# EAGLE board LCD-OLINUXINO-7TS_Rev_F (EAGLE 4.16)
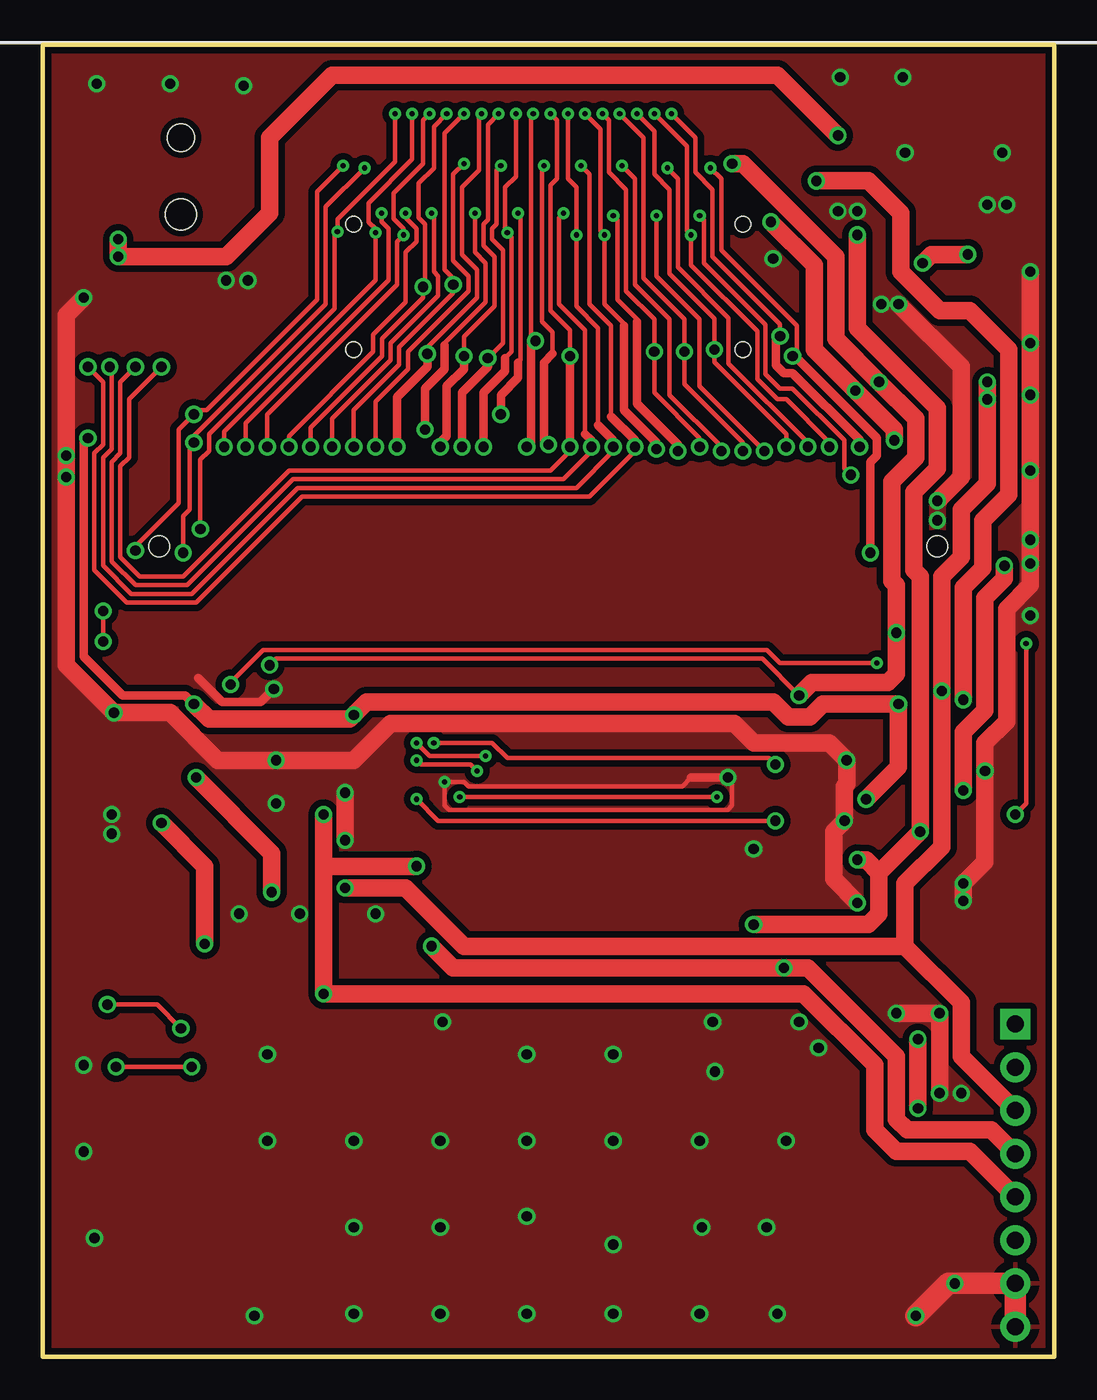
[diagram p1: board, top side]
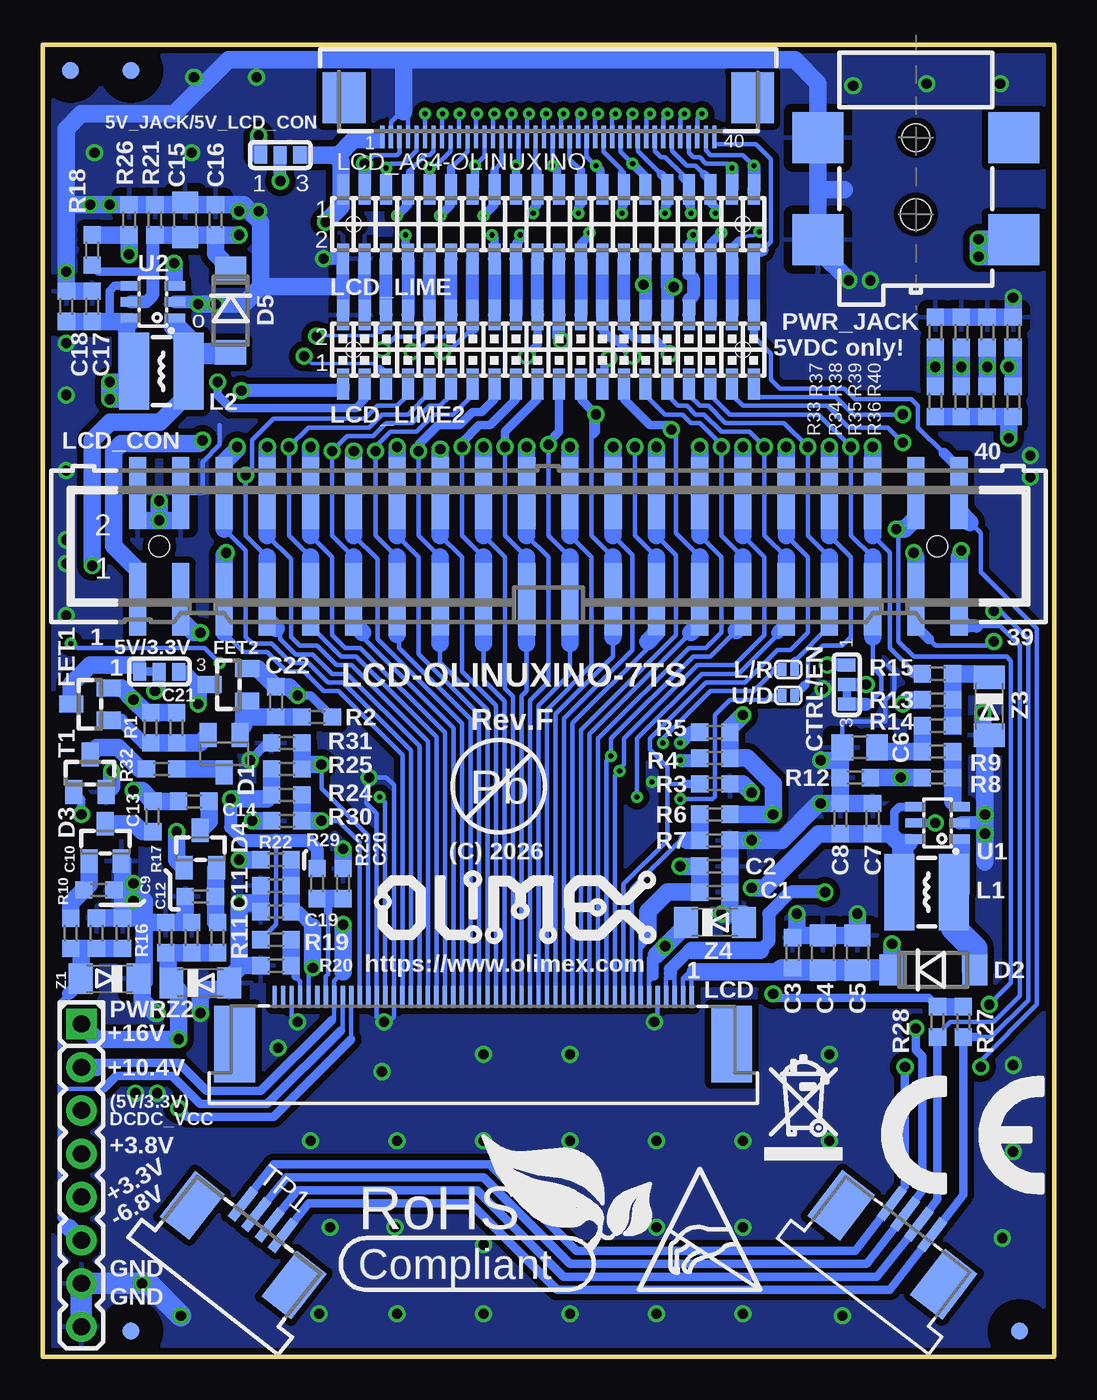
[diagram p2: board, bottom side, seen from below]

Size 59.44 x 77.09 mm. Coordinates in mm from the lower left corner, seen from the top.
Outline: 0,0 59.44,0 59.44,77.09 0,77.09 0,0
Copper layers (1+16): Top 0.035mm / dielectric 1.5mm / Bottom 0.035mm
Design rules "default": minimum track width 8mil, minimum drill 0.3mm, track to track 8mil, track to pad 8mil, pad to pad 8mil, via to via 8mil, smd to smd 1mil, copper to edge 10mil, drill to drill 12mil, minimum pad ring 8mil, minimum via ring 8mil, stop-mask expansion 4mil, vias tented up to drill 25mil, thermal gap 20mil
Net classes: 1 pwr: width 0.203 mm, drill 0.203 mm, clearance 0.203 mm

## Footprints (pad centres in the part's own frame; a part is rotated, then mirrored left to right if it is on the bottom)
SJ_2_SMALL_12_TIED = smd 0.762 x 1.016: 1 -1.143,0; 2 0,0; 3 1.143,0
SJ_2_SMALL = smd 0.762 x 1.016: 1 -1.143,0; 2 0,0; 3 1.143,0
C0603_DWS = smd 1.016 x 1.016: 1 -0.889,0; 2 0.889,0
C0805_5MIL_DWS = smd 1.27 x 1.524: 1 -1.016,0; 2 1.016,0
SJ_2_SMALL_23_TIED = smd 0.762 x 1.016: 1 -1.143,0; 2 0,0; 3 1.143,0
SOT23C = smd 1.4 x 1: 1 1.1,-0.95; 2 1.1,0.95; 3 -1.1,0
MLL-41 = smd 1.45 x 1.8: A 2.445,0; K -2.445,0
SOT23C(BAT54S) = smd 1.4 x 1: 1 1.1,-0.95; 2 1.1,0.95; 3 -1.1,0
SOT23 = smd 1.4 x 1: 1 1.1,-0.95; 2 1.1,0.95; 3 -1.1,0
CD42(43) = smd 1.75 x 4.5: 1 -1.6,0; 2 1.6,0
SJ_1_SMALLER = smd 0.508 x 0.762: 1 -0.381,0; 2 0.381,0
LCD7"_TOUCH(AT070TN90) = smd 0.25 x 1.3 bottom: 1 69.05,40.45; 2 69.55,40.45; 3 70.05,40.45; 4 70.55,40.45; 5 71.05,40.45; 6 71.55,40.45; 7 72.05,40.45; 8 72.55,40.45; 9 73.05,40.45; 10 73.55,40.45; 11 74.05,40.45; 12 74.55,40.45; 13 75.05,40.45; 14 75.55,40.45; 15 76.05,40.45; 16 76.55,40.45; 17 77.05,40.45; 18 77.55,40.45; 19 78.05,40.45; 20 78.55,40.45; 21 79.05,40.45; 22 79.55,40.45; 23 80.05,40.45; 24 80.55,40.45; 25 81.05,40.45; 26 81.55,40.45; 27 82.05,40.45; 28 82.55,40.45; 29 83.05,40.45; 30 83.55,40.45; 31 84.05,40.45; 32 84.55,40.45; 33 85.05,40.45; 34 85.55,40.45; 35 86.05,40.45; 36 86.55,40.45; 37 87.05,40.45; 38 87.55,40.45; 39 88.05,40.45; 40 88.55,40.45; 41 89.05,40.45; 42 89.55,40.45; 43 90.05,40.45; 44 90.55,40.45; 45 91.05,40.45; 46 91.55,40.45; 47 92.05,40.45; 48 92.55,40.45; 49 93.05,40.45; 50 93.55,40.45 | smd 0.55 x 2.2 rotated 217.5 bottom: 51 54.913,26.473; 52 55.707,27.082; 53 56.5,27.691; 54 57.294,28.299 | smd 2.4 x 4.5 bottom: P1 95.9,37.675; P2 66.7,37.675 | smd 2.4 x 3.4 rotated 217.5 bottom: P3 60.275,28.192; P4 54.245,23.566
FPV-WZA21-40-LF = smd 0.25 x 1.3: 1 -9.75,-2.75; 2 -9.25,-2.75; 3 -8.75,-2.75; 4 -8.25,-2.75; 5 -7.75,-2.75; 6 -7.25,-2.75; 7 -6.75,-2.75; 8 -6.25,-2.75; 9 -5.75,-2.75; 10 -5.25,-2.75; 11 -4.75,-2.75; 12 -4.25,-2.75; 13 -3.75,-2.75; 14 -3.25,-2.75; 15 -2.75,-2.75; 16 -2.25,-2.75; 17 -1.75,-2.75; 18 -1.25,-2.75; 19 -0.75,-2.75; 20 -0.25,-2.75; 21 0.25,-2.75; 22 0.75,-2.75; 23 1.25,-2.75; 24 1.75,-2.75; 25 2.25,-2.75; 26 2.75,-2.75; 27 3.25,-2.75; 28 3.75,-2.75; 29 4.25,-2.75; 30 4.75,-2.75; 31 5.25,-2.75; 32 5.75,-2.75; 33 6.25,-2.75; 34 6.75,-2.75; 35 7.25,-2.75; 36 7.75,-2.75; 37 8.25,-2.75; 38 8.75,-2.75; 39 9.25,-2.75; 40 9.75,-2.75 | smd 2.5 x 3: P1 12,-0.45; P2 -12,-0.45
ML40-MALE(GBH-254-SMT-40)_TEST = smd 1 x 4.25: 1 -24.13,-3.125; 2 -24.13,3.125; 3 -21.59,-3.125; 4 -21.59,3.125; 5 -19.05,-3.125; 6 -19.05,3.125; 7 -16.51,-3.125; 8 -16.51,3.125; 9 -13.97,-3.125; 10 -13.97,3.125; 11 -11.43,-3.125; 12 -11.43,3.125; 13 -8.89,-3.125; 14 -8.89,3.125; 15 -6.35,-3.125; 16 -6.35,3.125; 17 -3.81,-3.125; 18 -3.81,3.125; 19 -1.27,-3.125; 20 -1.27,3.125; 21 1.27,-3.125; 22 1.27,3.125; 23 3.81,-3.125; 24 3.81,3.125; 25 6.35,-3.125; 26 6.35,3.125; 27 8.89,-3.125; 28 8.89,3.125; 29 11.43,-3.125; 30 11.43,3.125; 31 13.97,-3.125; 32 13.97,3.125; 33 16.51,-3.125; 34 16.51,3.125; 35 19.05,-3.125; 36 19.05,3.125; 37 21.59,-3.125; 38 21.59,3.125; 39 24.13,-3.125; 40 24.13,3.125 | hole 1.2: -22.86,0; 22.86,0
YA-V36P-2X20-LF_0.9DRILL = smd 0.7 x 1.8: 1 -12.065,2.032; 2 -12.065,-2.032; 3 -10.795,2.032; 4 -10.795,-2.032; 5 -9.525,2.032; 6 -9.525,-2.032; 7 -8.255,2.032; 8 -8.255,-2.032; 9 -6.985,2.032; 10 -6.985,-2.032; 11 -5.715,2.032; 12 -5.715,-2.032; 13 -4.445,2.032; 14 -4.445,-2.032; 15 -3.175,2.032; 16 -3.175,-2.032; 17 -1.905,2.032; 18 -1.905,-2.032; 19 -0.635,2.032; 20 -0.635,-2.032; 21 0.635,2.032; 22 0.635,-2.032; 23 1.905,2.032; 24 1.905,-2.032; 25 3.175,2.032; 26 3.175,-2.032; 27 4.445,2.032; 28 4.445,-2.032; 29 5.715,2.032; 30 5.715,-2.032; 31 6.985,2.032; 32 6.985,-2.032; 33 8.255,2.032; 34 8.255,-2.032; 35 9.525,2.032; 36 9.525,-2.032; 37 10.795,2.032; 38 10.795,-2.032; 39 12.065,2.032; 40 12.065,-2.032 | hole 0.9: -11.43,0; 11.43,0
GPH127SMT-02X20(PA-V16X-2X20-LF)_DRILL_0.9MM = smd 0.7 x 1.8: 1 -12.065,-2.032; 2 -12.065,2.032; 3 -10.795,-2.032; 4 -10.795,2.032; 5 -9.525,-2.032; 6 -9.525,2.032; 7 -8.255,-2.032; 8 -8.255,2.032; 9 -6.985,-2.032; 10 -6.985,2.032; 11 -5.715,-2.032; 12 -5.715,2.032; 13 -4.445,-2.032; 14 -4.445,2.032; 15 -3.175,-2.032; 16 -3.175,2.032; 17 -1.905,-2.032; 18 -1.905,2.032; 19 -0.635,-2.032; 20 -0.635,2.032; 21 0.635,-2.032; 22 0.635,2.032; 23 1.905,-2.032; 24 1.905,2.032; 25 3.175,-2.032; 26 3.175,2.032; 27 4.445,-2.032; 28 4.445,2.032; 29 5.715,-2.032; 30 5.715,2.032; 31 6.985,-2.032; 32 6.985,2.032; 33 8.255,-2.032; 34 8.255,2.032; 35 9.525,-2.032; 36 9.525,2.032; 37 10.795,-2.032; 38 10.795,2.032; 39 12.065,-2.032; 40 12.065,2.032 | hole 0.9: -11.43,0; 11.43,0
HN1X8 = drill 1 pad 1.778 square: 1 -8.89,0 | drill 1 pad 1.778 round: 2 -6.35,0; 3 -3.81,0; 4 -1.27,0; 5 1.27,0; 6 3.81,0; 7 6.35,0; 8 8.89,0
PWR-JACK-SMD = smd 3 x 3: 1 6,5.75; 2 0,-5.75; 3 6,-5.75; 4 0,5.75 | hole 1.6: 0,0 | hole 1.8: 4.5,0
R0603_5MIL_DWS = smd 1.016 x 1.016: 1 -0.889,0; 2 0.889,0
SOT-23 = smd 1.4 x 1: 1 1.1,-0.95; 2 1.1,0.95; 3 -1.1,0
FPA-WZA25-04-LF = smd 0.55 x 2.2: P$1 1.5,0.4; P$2 0.5,0.4; P$3 -0.5,0.4; P$4 -1.5,0.4 | smd 2.2 x 3.4: P$5 3.8,-1.5; P$6 -3.8,-1.5
SOT23-6 = smd 1.2 x 0.55: 1 1.3,-0.95; 2 1.3,0; 3 1.3,0.95; 4 -1.3,0.95; 5 -1.3,0; 6 -1.3,-0.95
FIDUCIAL-1X3 = smd 1 x 1: 1 0,0
FIDUCIAL-1X3_CREAM = smd 1 x 1: 1 0,0
MINI-MELF = smd 1.4 x 1.8: 1 -1.7,0; 2 1.7,0

## Placement (x,y rotation side)
5V/3.3V  5V:Close/3.3V:Open  [SJ_2_SMALL_12_TIED]  52.58,40.26 0 bottom
5V_JACK/5V_LCD_CON  5V_JACK:Open/5V_LCD_CON:Soldered  [SJ_2_SMALL]  45.47,70.61 0 bottom
C1  22uF/6.3V  [C0603_DWS]  19.94,27.3 0 bottom
C2  100nF/Y5V/50VDC/20%  [C0603_DWS]  19.94,28.83 0 bottom
C3  100nF/Y5V/50VDC/20%  [C0603_DWS]  15.37,23.75 90 bottom
C4  1uF/25V/20%  [C0805_5MIL_DWS]  13.59,23.75 90 bottom
C5  1uF/25V/20%  [C0805_5MIL_DWS]  11.56,23.75 90 bottom
C6  10uF/16V  [C0805_5MIL_DWS]  11.43,35.81 180 bottom
C7  22uF/6.3V  [C0603_DWS]  10.67,31.62 270 bottom
C8  22uF/6.3V  [C0603_DWS]  12.57,31.62 270 bottom
C9  100nF/Y5V/50VDC/20%  [C0603_DWS]  56.26,24.89 90 bottom
C10  100nF/Y5V/50VDC/20%  [C0603_DWS]  56.13,27.43 0 bottom
C11  100nF/Y5V/50VDC/20%  [C0603_DWS]  50.16,27.05 180 bottom
C12  100nF/Y5V/50VDC/20%  [C0603_DWS]  52.2,24.64 90 bottom
C13  100nF/Y5V/50VDC/20%  [C0603_DWS]  52.96,31.75 90 bottom
C14  100nF/Y5V/50VDC/20%  [C0603_DWS]  50.55,32.64 0 bottom
C15  10uF/16V  [C0805_5MIL_DWS]  51.05,66.8 90 bottom
C16  100nF/Y5V/50VDC/20%  [C0603_DWS]  49.28,66.8 90 bottom
C17  22uF/6.3V  [C0603_DWS]  56.52,61.72 270 bottom
C18  22uF/6.3V  [C0603_DWS]  58.04,61.72 270 bottom
C19  100nF/Y5V/50VDC/20%  [C0603_DWS]  45.72,26.16 180 bottom
C20  100nF/Y5V/50VDC/20%  [C0603_DWS]  41.78,27.81 90 bottom
C21  22uF/6.3V  [C0603_DWS]  51.56,36.96 270 bottom
C22  100nF/Y5V/50VDC/20%  [C0603_DWS]  45.72,38.48 270 bottom
CTRL/EN  CTRL:Close/EN:Open  [SJ_2_SMALL_23_TIED]  12.19,39.5 270 bottom
D1  BAT54C  [SOT23C]  48.77,35.43 90 bottom
D2  1N5819/SS14  [MLL-41]  7.11,22.73 0 bottom
D3  BAT54S  [SOT23C(BAT54S)]  55.75,30.23 270 bottom
D4  BAT54S  [SOT23C(BAT54S)]  50.16,29.84 270 bottom
D5  1N5819/SS14  [MLL-41]  48.39,61.47 270 bottom
FET1  IRLML6402  [SOT23]  56.64,38.35 0 bottom
FET2  IRLML6402  [SOT23]  48.51,39.5 0 bottom
L1  4.7uH/1.15A/DCR<0.1R/CD43  [CD42(43)]  7.49,27.3 0 bottom
L2  4.7uH/1.15A/DCR<0.1R/CD43  [CD42(43)]  52.45,57.91 0 bottom
L/R  Open  [SJ_1_SMALLER]  15.62,40.39 0 bottom
LCD  FPV-WZA21-50-LF  [LCD7"_TOUCH(AT070TN90)]  -47.75,-19.29 0 top
LCD_A64-OLINUXINO  FPV-WZA21-40-LF  [FPV-WZA21-40-LF]  29.72,74.42 0 bottom
LCD_CON  GBH254SMT-40 (B-V-40-LF)  [ML40-MALE(GBH-254-SMT-40)_TEST]  29.72,47.62 0 bottom
LCD_LIME  MALE-PAV16X-2x20-HIGH-TUBE  [YA-V36P-2X20-LF_0.9DRILL]  29.72,66.55 0 bottom
LCD_LIME2  MALE-PAV16X-2x20-HIGH-TUBE  [GPH127SMT-02X20(PA-V16X-2X20-LF)_DRILL_0.9MM]  29.72,59.18 0 bottom
PWR  NA(HN1X8)  [HN1X8]  57.15,10.67 270 bottom
PWR_JACK  DCJ-W54R-20-LF  [PWR-JACK-SMD]  8.13,71.63 270 bottom
R1  20k/1%  [R0603_5MIL_DWS]  53.09,36.96 90 bottom
R2  20k/1%  [R0603_5MIL_DWS]  43.31,37.59 0 bottom
R3  NA  [R0603_5MIL_DWS]  19.94,33.66 180 bottom
R4  NA  [R0603_5MIL_DWS]  19.94,35.18 180 bottom
R5  NA  [R0603_5MIL_DWS]  19.94,36.7 180 bottom
R6  NA  [R0603_5MIL_DWS]  19.94,31.88 180 bottom
R7  10k  [R0603_5MIL_DWS]  19.94,30.35 180 bottom
R8  2.2k  [R0603_5MIL_DWS]  6.86,34.04 180 bottom
R9  20k/1%  [R0603_5MIL_DWS]  6.86,35.56 180 bottom
R10  1k/1%  [R0603_5MIL_DWS]  57.78,24.89 90 bottom
R11  1k/1%  [R0603_5MIL_DWS]  49.15,24.64 90 bottom
R12  1.1R/1%/R0603  [R0603_5MIL_DWS]  11.68,34.04 180 bottom
R13  4.7k  [R0603_5MIL_DWS]  6.86,38.61 180 bottom
R14  4.7k  [R0603_5MIL_DWS]  6.86,37.08 180 bottom
R15  220R  [R0603_5MIL_DWS]  6.86,40.13 0 bottom
R16  51.1k/1%  [R0603_5MIL_DWS]  54.74,24.89 270 bottom
R17  51.1k/1%  [R0603_5MIL_DWS]  50.67,24.64 270 bottom
R18  51.1k/1%  [R0603_5MIL_DWS]  56.52,65.02 270 bottom
R19  10k  [R0603_5MIL_DWS]  45.72,24.51 0 bottom
R20  NA  [R0603_5MIL_DWS]  45.72,22.99 0 bottom
R21  20k/1%  [R0603_5MIL_DWS]  52.83,66.8 270 bottom
R22  1k/1%  [R0603_5MIL_DWS]  45.72,29.21 0 bottom
R23  10k  [R0603_5MIL_DWS]  43.31,27.81 270 bottom
R24  NA  [R0603_5MIL_DWS]  45.09,33.02 0 bottom
R25  10k  [R0603_5MIL_DWS]  45.09,34.54 0 bottom
R26  1k/1%  [R0603_5MIL_DWS]  54.36,66.8 90 bottom
R27  NA  [R0603_5MIL_DWS]  5.33,19.68 270 bottom
R28  NA  [R0603_5MIL_DWS]  6.86,19.68 270 bottom
R29  562R/1%  [R0603_5MIL_DWS]  45.72,27.69 180 bottom
R30  10k  [R0603_5MIL_DWS]  45.09,31.5 180 bottom
R31  NA  [R0603_5MIL_DWS]  45.09,36.07 180 bottom
R32  1k/1%  [R0603_5MIL_DWS]  52.45,34.54 0 bottom
R33  NA  [R0603_5MIL_DWS]  6.99,56.13 270 bottom
R34  NA  [R0603_5MIL_DWS]  5.46,56.13 270 bottom
R35  51.1k/1%  [R0603_5MIL_DWS]  3.94,56.13 270 bottom
R36  51.1k/1%  [R0603_5MIL_DWS]  2.41,56.13 270 bottom
R37  51.1k/1%  [R0603_5MIL_DWS]  6.99,60.2 270 bottom
R38  51.1k/1%  [R0603_5MIL_DWS]  5.46,60.2 270 bottom
R39  NA  [R0603_5MIL_DWS]  3.94,60.2 270 bottom
R40  NA  [R0603_5MIL_DWS]  2.41,60.2 270 bottom
T1  LMUN2211LT1G  [SOT-23]  56.64,34.29 270 bottom
TP1  FPA-WZB-25-04-LF  [FPA-WZA25-04-LF]  46.74,7.75 322 bottom
U1  AP3031KTR-G1  [SOT23-6]  6.86,31.37 0 bottom
U2  AP3031KTR-G1  [SOT23-6]  52.96,61.98 0 bottom
U$1  FIDUCIAL  [FIDUCIAL-1X3]  2.03,1.52 270 bottom
U$2  FIDUCIAL1X3_CREAM  [FIDUCIAL-1X3_CREAM]  54.23,1.52 270 bottom
U$3  FIDUCIAL  [FIDUCIAL-1X3]  54.23,75.56 270 bottom
U$4  [CE]  10.16,9.53 0 bottom
U$6  FIDUCIAL1X3_CREAM  [FIDUCIAL-1X3_CREAM]  57.78,75.56 0 bottom
U$8  [OLIMEX1_V]  22.23,24.14 0 bottom
U$9  [PB]  32.64,33.53 0 bottom
U$10  [ESD_SYMBOL]  24.38,3.94 0 bottom
U$11  [RECYCLE_BIN1/8]  17.02,11.56 0 bottom
U$12  [ROHS]  40.89,4.57 0 bottom
U/D  Open  [SJ_1_SMALLER]  15.62,38.86 0 bottom
Z1  BZV55C10  [MINI-MELF]  55.5,22.23 180 bottom
Z2  BZV55C16  [MINI-MELF]  50.16,21.97 0 bottom
Z3  NA(BZV55C3V6)  [MINI-MELF]  3.81,38.23 270 bottom
Z4  NA(BZV55C4V3)  [MINI-MELF]  19.94,25.53 0 bottom

## Tracks (layer width: path | path; a pad name or v marks a point on that pad's centre or on a via)
+5V  (via drill 0.6)
  Top 1.016: 50.67,24.13 24.77,24.13 21.34,27.56 v17.78,27.56 | 50.67,24.13 50.67,27.81 52.83,29.97 v52.83,39.12 52.83,45.85 53.98,46.99 53.98,49.78 55.5,51.31 v55.5,56.26 v55.5,57.28 | 50.67,24.13 53.98,20.83 53.98,17.65 PWR.3
  Bottom 0.508: 54.23,60.83 54.23,61.03 U2.6 | U2.4 55.18,62.93 55.5,62.61 55.5,60.83 | U1.4 9.08,32.32 9.4,32 9.4,30.99 9.65,30.73 | U1.6 8.26,30.42 8.26,30.23 8.51,30.23
  Bottom 0.762: 5V/3.3V.2 52.58,39.37 v52.83,39.12
  Bottom 1.016: C18.2 C17.2 55.5,60.83 54.48,60.83 | 54.48,60.83 54.23,60.83 | v17.78,27.56 17.02,27.56 13.84,30.73 C8.2 C7.2 9.65,30.73 9.14,30.23 8.89,30.23 | 8.89,30.23 8.51,30.23 | L1.1 8.89,27.3 | 8.89,29.72 8.89,30.23 | L2.1 54.05,57.28 54.36,57.28 | 54.48,57.28 54.36,57.28 | 54.48,57.28 v55.5,57.28 v55.5,56.26 54.36,56.26 54.36,57.28 | 54.48,57.28 54.48,60.83
  Bottom 1.27: 8.89,27.3 8.89,29.72
+12V  (via drill 0.6)
  Top 1.016: v47.88,65.91 47.88,60.45 52.58,55.75 52.58,52.2 51.18,50.8 51.18,46.23 51.56,45.85 v51.56,30.86 49.15,28.45 | v41.78,25.4 48.51,25.4 49.15,26.04 49.15,28.45 | v47.88,29.21 48.39,29.21 49.15,28.45
  Bottom 0.254: 42.42,19.8 42.3,19.93 LCD.43 42.3,22.09 41.78,22.61
  Bottom 0.508: 52.97,63.75 56.13,63.75 R18.2 | 42.42,19.8 46.61,15.62 49.78,15.62 51.44,17.27 56.01,17.27 56.26,17.02
  Bottom 0.762: U2.5 53.35,61.98 52.97,62.36 52.97,63.75 52.97,65.91 R21.2
  Bottom 1.016: 51.05,65.91 R21.2 | 51.05,65.91 C15.1 | C16.1 51.05,65.91 | C16.1 49.28,64.8 D5.K | D4.1 51.56,29.19 v51.56,30.86 | v47.88,29.21 R22.1 | 56.26,17.02 PWR.2 | 41.78,22.61 v41.78,25.4 | v47.88,65.91 C16.1
+15V  (via drill 0.6)
  Top 1.016: v51.44,14.61 v51.44,18.67
  Bottom 0.254: 41.3,18.65 LCD.41
  Bottom 0.508: v51.44,14.61 50.93,14.1 45.85,14.1 41.3,18.65
  Bottom 1.016: R11.1 R17.2 52.07,23.75 | PWR.1 56.26,18.67 v51.44,18.67 51.44,21.54 Z2.1 52.07,22.18 52.07,23.75 | 52.07,23.75 C12.1
-24V
  Bottom 0.254: 57.91,21.34 58.42,20.83 58.42,15.75 | 57.91,7.62 58.42,8.13 58.42,15.75 | 55.88,15.75 58.42,15.75 | 41.91,19.18 41.8,19.29 LCD.42
  Bottom 0.508: 55.88,15.75 55.12,16.51 51.82,16.51 50.16,14.86 46.23,14.86 41.91,19.18
  Bottom 0.762: Z1.2 57.2,22.05 57.91,21.34
  Bottom 1.016: 57.91,7.62 PWR.6 | 57.15,24 C9.1 R16.2 | 57.15,24 R10.1 | Z1.2 57.15,22.27 57.15,24
GND  (via drill 0.3, 0.6, 0.6 pad 1.02)
  Top 0.254: 38.1,34.04 37.59,33.53 25.02,33.53 24.77,33.78 v23.62,33.78 23.62,32.38 23.88,32.13 40.26,32.13 40.51,32.38 40.51,33.78 v40.26,34.04
  Top 0.508: v40.26,34.04 38.1,34.04 | 9.14,39.88 10.54,38.48 12.83,38.48 v13.59,39.24
  Top 1.016: v47.88,26.67 46.48,28.07 46.48,30.86 v47.12,31.5 47.12,33.53 47.24,33.66 v47.24,35.05 46.23,36.07 41.78,36.07 40.64,37.21 20.45,37.21 18.29,35.05 v13.72,35.05 10.29,35.05 7.49,37.85 v4.19,37.85 1.4,40.64 v1.4,51.69 v1.4,52.96 1.4,61.21 v2.41,62.23 | v17.78,30.35 v17.78,33.15 | v50.16,20.19 v52.7,20.19 v52.7,15.49 | v58.04,63.75 v58.04,48.01 v58.04,46.61 58.04,45.34 56.64,43.94 56.64,37.34 55.37,36.07 v55.37,34.42 55.37,29.08 v54.1,27.81 v54.1,26.8 | v52.58,50.29 53.98,51.69 53.98,58.17 v50.29,61.85
  Top 1.27: PWR.8 PWR.7 v53.59,4.32 53.21,4.32 v51.31,2.41
  Bottom 0.254: LCD_A64-OLINUXINO.2 38.97,72.54 38.35,73.15 38.23,73.15 37.97,72.89 LCD_A64-OLINUXINO.4 | LCD.5 23.3,19.88 v23.5,19.68 | v44.45,19.68 44.8,20.03 LCD.48 | C6.2 12.45,37.34 9.91,37.34 9.91,38.61 9.4,39.12 9.4,40.26 9.78,40.64 | LCD_CON.4 50.04,50.75 50.04,52.58 49.02,53.59 49.02,54.74 | 40.39,32.51 39.8,31.92 LCD.38 39.8,19.99 39.5,19.68 v39.37,19.68 39.12,19.68 38.8,20 LCD.36 38.8,33.59 39.24,34.04 v40.26,34.04 40.39,33.91 40.39,32.51
  Bottom 0.508: 46.1,31.5 R30.2 | R31.2 46.23,36.07 v47.24,35.05
  Bottom 0.762: v50.29,61.85 50.42,61.98 U2.2 | 41.78,62.87 LCD_LIME2.2 | 41.78,62.87 LCD_LIME.2 v42.93,64.52 | 40.51,62.87 LCD_LIME2.4 | 40.51,62.87 LCD_LIME.4 | 41.78,62.87 40.51,62.87 | 4.06,31.37 U1.2
  Bottom 1.016: v50.29,61.85 v49.28,61.85 47.62,61.85 46.61,62.87 | C17.1 C18.1 v58.04,63.75 58.04,67.69 | 51.05,67.69 R21.1 R26.2 v55.5,67.69 58.04,67.69 | 51.05,67.69 C15.2 | 51.05,67.69 C16.2 47.62,67.69 46.61,66.67 46.61,62.87 | 51.05,25.53 C11.2 | 46.61,26.67 R29.2 | 46.61,26.67 v47.88,26.67 47.88,23.11 47.75,22.99 | 46.61,26.67 C19.2 | v47.12,31.5 46.1,31.5 | 15.11,24.77 C4.2 C5.2 v11.56,26.04 | 15.11,24.77 15.37,24.77 C3.2 15.24,24.77 15.11,24.77 | C8.1 C7.1 | C8.1 R12.2 12.57,35.05 | C6.2 12.57,35.69 12.57,35.05 | v13.72,35.05 12.57,35.05 | v17.78,33.15 18.29,33.66 R3.1 | 46.61,62.87 41.78,62.87 | LCD_CON.4 51.31,49.15 v52.58,49.15 | v52.58,49.15 53.85,49.15 LCD_CON.2 | v4.19,37.85 4.19,36.53 Z3.2 4.06,36.53 v4.06,31.88 4.06,31.37 v4.06,30.73 4.06,29.08 | T1.2 55.37,33.51 v55.37,34.42 | 58.04,67.69 58.04,72.14 57.15,73.03 51.69,73.03 48.51,76.2 38.23,76.2 | 38.23,76.2 38.23,73.15 | 38.23,76.2 15.24,76.2 13.88,74.84 PWR_JACK.2 13.88,68.58 | C8.1 v13.72,32.51 13.84,32.51 16,30.35 v17.78,30.35 R7.1 C2.2 C1.2 19.05,26.04 | 15.11,24.77 v15.11,26.04 | 47.75,22.99 R20.1 | D3.2 54.74,29.13 54.74,27.43 | 54.74,27.43 C10.2 | 54.1,27.43 v54.1,27.81 | 54.74,27.43 54.1,27.43 | R16.1 54.74,27.43 | R16.1 C9.2 | C20.2 v41.78,29.84 | 54.1,27.43 v54.1,26.8 53.47,26.8 53.47,25.53 | 51.05,25.53 R17.1 | 51.05,25.53 C12.2 53.47,25.53 | v52.7,20.19 52.83,20.19 53.59,20.95 53.59,22.02 | 53.59,22.02 Z1.1 | v50.16,20.19 50.16,21.21 49.78,21.59 48.47,21.59 Z2.2 48.47,22.27 47.75,22.99 | 53.59,22.02 53.47,22.02 53.47,25.53 | 53.47,25.53 53.72,25.78 R16.1 | 19.05,26.04 v19.56,26.04 | Z4.2 18.24,26.04 19.05,26.04 | 13.88,68.58 PWR_JACK.3 13.88,65.06 v12.06,63.25
  Bottom 1.016: 13.88,68.58 12.32,68.58 | v2.41,62.23 R40.1 R39.1 R38.1 R37.1 | v52.58,50.29 v52.58,49.15
  Bottom 1.27: PWR.8 PWR.7 v53.59,4.32 53.21,4.32 v51.31,2.41
  other vias: 18.29,2.54 18.29,7.62 18.29,12.7 13.21,12.7 13.21,17.78 23.37,12.7 23.37,7.62 23.37,2.54 28.45,2.54 33.53,2.54 38.61,2.54 43.18,2.54 42.55,7.62 43.69,12.7 53.98,15.49 38.61,12.7 33.53,12.7 28.45,12.7 28.45,8.26 28.45,17.78 33.53,17.78 39.5,16.76 3.05,6.99 2.41,12.06 2.41,17.14 58.04,43.56 56.39,70.74 56.64,67.69 58.04,52.07 58.04,56.52 45.59,18.16 38.73,7.62 33.53,6.6 12.45,2.41 11.81,74.68 7.49,74.8 3.17,74.8 46.86,75.18 50.55,75.18 50.67,70.74 10.79,63.25 58.04,59.56 47.88,67.31 46.74,67.31
  pour Top (isolate 0.381, rank 2): -4.57,77.98 -4.57,-2.54 64.01,-2.54 64.01,77.98
  pour Bottom (isolate 0.381, rank 3): -7.11,-5.08 66.55,-5.08 66.55,80.52 -7.11,80.52
LCD_B0  (via drill 0.3, 0.6)
  Top 0.254: v29.46,69.98 29.34,69.85 29.34,60.83 29.97,60.2 29.97,58.93
  Top 0.508: 29.97,58.93 29.46,58.42 29.46,53.85 v29.72,53.59
  Bottom 0.254: LCD.19 30.3,38.28 28.45,40.13 28.45,41.92 | 28.45,46.99 29.72,48.26 v29.72,53.59 | LCD_A64-OLINUXINO.21 v29.47,69.98 v29.46,69.98
  Bottom 0.508: v29.46,69.98 29.21,69.72 29.21,68.71 LCD_LIME.21 | LCD_LIME2.21 29.08,54.36 29.72,53.72 v29.72,53.59
  Bottom 1.016: 28.45,41.92 LCD_CON.21 28.45,46.99
LCD_B1  (via drill 0.3, 0.6)
  Top 0.254: v28.96,59.69 28.7,59.94 28.7,72.9 v28.83,73.03
  Top 0.508: v28.96,59.69 28.7,59.44 28.7,53.72 v28.45,53.47
  Bottom 0.254: LCD.18 29.8,38.02 27.18,40.64 27.18,46.99 28.45,48.26 | LCD_A64-OLINUXINO.22 28.97,72.89 v28.83,73.03
  Bottom 0.762: LCD_LIME.22 LCD_LIME2.22 29.08,59.82 v28.96,59.69
  Bottom 1.016: 28.45,48.26 LCD_CON.22 v28.45,53.47
LCD_B2  (via drill 0.3, 0.6)
  Top 0.254: v27.94,67.18 28.07,67.06 28.07,58.55 27.94,58.42
  Top 0.508: 27.94,58.42 27.94,57.53 26.92,56.52 v26.92,55.37
  Bottom 0.254: LCD.17 29.3,37.76 25.91,41.15 25.91,42.31 | 25.91,46.99 27.18,48.26 27.18,55.63 | LCD_A64-OLINUXINO.23 28.47,70.38 27.81,69.72
  Bottom 0.508: v27.94,67.18 27.94,67.56 27.81,67.69 LCD_LIME.23 27.81,69.72 | LCD_LIME2.23 27.81,56.26 27.18,55.63 v26.92,55.37 26.92,54.36 27.05,54.23
  Bottom 1.016: 25.91,42.31 LCD_CON.23 25.91,46.99
LCD_B3  (via drill 0.3, 0.6)
  Top 0.254: 27.18,58.67 27.56,59.05 27.56,65.79 v27.3,66.04 27.18,66.17 27.18,68.71 27.81,69.34 v27.81,73.03
  Top 0.508: 27.18,58.67 27.18,57.91 25.91,56.64 v25.91,53.47
  Bottom 0.254: LCD.16 28.8,37.5 24.77,41.53 24.77,47.12 25.91,48.26 | LCD_A64-OLINUXINO.24 27.97,72.87 v27.81,73.03
  Bottom 0.508: v27.3,66.04 27.3,65.91 27.81,65.41 LCD_LIME.24
  Bottom 0.762: LCD_LIME.24 LCD_LIME2.24
  Bottom 1.016: 25.91,48.26 LCD_CON.24 v25.91,53.47
LCD_B4  (via drill 0.3, 0.6)
  Top 0.254: v26.92,69.98 26.67,69.72 26.67,66.55 26.42,66.29 26.42,65.66 27.05,65.02 27.05,59.56 v26.16,58.67
  Top 0.508: v26.16,58.67 26.16,58.17 24.64,56.64 v24.64,53.47
  Bottom 0.254: LCD.15 28.3,37.23 23.88,41.66 23.88,42.04 | 23.37,46.99 24.64,48.26 v24.64,53.47 | LCD_A64-OLINUXINO.25 27.47,70.52 v26.92,69.98
  Bottom 0.508: v26.92,69.98 26.67,69.72 26.67,68.71 LCD_LIME.25 | LCD_LIME2.25 26.42,57.28 26.42,58.42 v26.16,58.67
  Bottom 1.016: 23.88,42.04 23.37,42.55 LCD_CON.25 23.37,46.99
LCD_B5  (via drill 0.3, 0.6)
  Top 0.254: v24.77,58.8 24.77,59.94 26.54,61.72 26.54,64.64 25.91,65.28 25.91,66.55 26.16,66.8 26.16,72.39 v26.8,73.03
  Top 0.508: v24.77,58.8 24.77,58.04 23.75,57.02 23.75,54.1 23.37,53.72 v23.37,53.47
  Bottom 0.254: LCD.14 27.8,36.84 22.23,42.42 22.23,47.12 23.37,48.26 | LCD_A64-OLINUXINO.26 26.97,72.85 v26.8,73.03
  Bottom 0.508: LCD_LIME2.26 26.54,60.33 26.04,59.82 25.78,59.82 v24.77,58.8
  Bottom 0.762: LCD_LIME2.26 LCD_LIME.26
  Bottom 1.016: 23.37,48.26 LCD_CON.26 v23.37,53.47
LCD_B6  (via drill 0.3, 0.6)
  Top 0.254: v25.4,67.18 25.4,64.9 26.04,64.26 26.04,61.98 23.62,59.56 23.62,59.44
  Top 0.508: 23.62,59.44 23.62,58.04 22.48,56.9 v22.48,54.48
  Bottom 0.254: LCD.13 27.3,36.58 21.34,42.55 | 20.83,46.99 22.23,48.39 22.23,54.23 v22.48,54.48 | LCD_A64-OLINUXINO.27 26.47,70.79 25.4,69.72 25.4,69.55
  Bottom 0.508: v25.4,67.18 25.4,67.56 25.27,67.69 LCD_LIME.27 25.4,68.71 25.4,69.55 | LCD_LIME2.27 25.27,56.26 23.75,54.74 22.73,54.74 v22.48,54.48
  Bottom 1.016: 21.34,42.55 20.83,43.05 LCD_CON.27 20.83,46.99
LCD_B7  (via drill 0.3, 0.6)
  Top 0.254: v22.61,58.93 22.61,59.31 25.53,62.23 25.53,63.88 24.64,64.77 24.64,68.71 25.65,69.72 25.65,72.9 v25.78,73.03
  Top 0.508: v22.61,58.93 22.61,58.17 20.83,56.39 v20.83,53.47
  Bottom 0.254: LCD.12 26.8,36.32 21.46,41.66 20.45,41.66 19.56,42.55 19.56,46.99 20.83,48.26 | LCD_A64-OLINUXINO.28 25.97,72.84 v25.78,73.03
  Bottom 0.508: LCD_LIME2.28 25.27,60.45 24.64,59.82 23.5,59.82 v22.61,58.93
  Bottom 0.762: LCD_LIME2.28 LCD_LIME.28
  Bottom 1.016: 20.83,48.26 LCD_CON.28 v20.83,53.47
LCD_BKL  (via drill 0.3, 0.6)
  Top 0.254: v10.67,53.47 10.67,54.36 19.56,63.25 v19.56,66.04 19.56,66.27 19.15,66.67 19.15,67.79 21.72,70.36 v21.72,73.03
  Bottom 0.254: 8.26,40.26 9.65,41.66 9.65,47.24 10.67,48.26 | LCD_A64-OLINUXINO.36 21.97,72.77 v21.72,73.03
  Bottom 0.508: LCD_LIME.36 20.19,65.41 v19.56,66.04
  Bottom 0.762: R15.1 7.75,40.26 8.26,40.26 | LCD_LIME.36 LCD_LIME2.36
  Bottom 1.016: 10.67,48.26 LCD_CON.36 v10.67,53.47
LCD_CLK  (via drill 0.3, 0.6)
  Top 0.254: v17.02,53.47 17.02,55.12 20.45,58.55 20.45,59.56 23.24,62.36 23.24,63.5 22.99,63.75 22.99,67.06 v22.86,67.18 | v24.51,32.89 v39.62,32.89
  Bottom 0.254: 15.75,46.99 17.02,48.26 v17.02,53.47 17.91,54.36 19.56,54.36 20.57,55.37 21.08,55.37 21.59,55.88 22.1,55.88 22.73,56.52 LCD_LIME2.31 | LCD_A64-OLINUXINO.31 24.47,70.82 23.11,69.47 | LCD.37 39.3,32.57 v39.62,32.89 | 16.26,42.55 16.26,42.42 18.54,40.13 20.7,40.13 24.51,36.32 v24.51,32.89
  Bottom 0.508: v22.86,67.18 22.86,67.56 22.73,67.69 LCD_LIME.31 22.73,69.09 23.11,69.47
  Bottom 0.762: 16.26,42.55 15.75,43.05 LCD_CON.31
  Bottom 1.016: LCD_CON.31 15.75,46.99
LCD_DE  (via drill 0.3, 0.6)
  Top 0.254: v15.75,53.47 15.75,54.61 19.94,58.8 19.94,59.82 22.35,62.23 v22.35,62.87 22.48,62.99 22.48,66.55 22.1,66.93 22.1,68.96 22.99,69.85 22.99,72.26 v23.75,73.03
  Bottom 0.254: LCD.9 25.3,27.79 22.73,30.35 22.73,33.66 | 22.73,33.66 22.73,34.67 23.75,35.69 23.75,36.32 20.45,39.62 18.16,39.62 16.26,41.53 15.49,41.53 14.48,42.55 14.48,46.99 15.75,48.26 | 22.73,33.66 21.59,33.66 | LCD_A64-OLINUXINO.32 23.97,72.81 v23.75,73.03
  Bottom 0.508: 21.59,33.66 R3.2
  Bottom 0.762: 22.73,62.87 LCD_LIME2.32 | 22.73,62.87 LCD_LIME.32 | v22.35,62.87 22.73,62.87
  Bottom 1.016: 15.75,48.26 LCD_CON.32 v15.75,53.47
LCD_G0  (via drill 0.3, 0.6)
  Top 0.254: v34.04,69.98 34.8,69.22 34.8,62.99 36.83,60.96 36.83,56.52 39.88,53.47 v39.88,53.21
  Bottom 0.254: LCD.27 34.3,37.47 38.48,41.66 38.48,42.31 38.61,42.43 | LCD_LIME2.13 34.16,56.52 35.31,55.37 36.45,55.37 37.47,54.36 38.99,54.36 39.88,53.47 v39.88,53.21 39.88,48.26 38.61,46.99 | LCD_A64-OLINUXINO.13 33.47,70.55 v34.04,69.98
  Bottom 0.508: v34.04,69.98 34.04,68.71 LCD_LIME.13
  Bottom 1.016: 38.61,42.43 LCD_CON.13 38.61,46.99
LCD_G1  (via drill 0.3, 0.6)
  Top 0.254: v38.61,53.47 38.61,53.98 35.94,56.64 v35.94,59.05 35.94,60.96 34.29,62.61 34.29,68.58 33.27,69.6 33.27,72.64 v32.89,73.03
  Bottom 0.254: LCD.26 33.8,37.75 37.34,41.29 37.34,46.99 38.61,48.26 | 34.16,60.45 35.31,59.31 35.69,59.31 v35.94,59.05 | LCD_A64-OLINUXINO.14 32.97,72.95 v32.89,73.03
  Bottom 0.762: LCD_LIME.14 LCD_LIME2.14 34.16,60.45
  Bottom 1.016: 38.61,48.26 LCD_CON.14 v38.61,53.47
LCD_G2  (via drill 0.3, 0.6)
  Top 0.254: v33.53,67.06 33.78,66.8 33.78,62.1 34.92,60.96 34.92,60.83
  Top 0.508: 34.92,60.83 34.92,56.01 37.34,53.59 v37.34,53.21
  Bottom 0.254: LCD.25 33.3,38.01 36.07,40.78 36.07,41.92 | 36.07,46.99 37.34,48.26 v37.34,53.21 | LCD_A64-OLINUXINO.15 32.47,70.15 32.89,69.72
  Bottom 0.508: v33.53,67.06 32.89,67.69 LCD_LIME.15 32.89,69.72 | v37.34,53.21 37.34,53.59 36.2,54.74 34.92,54.74 34.16,55.5 33.66,55.5 32.89,56.26 LCD_LIME2.15
  Bottom 1.016: 36.07,41.92 LCD_CON.15 36.07,46.99
LCD_G3  (via drill 0.3, 0.6)
  Top 0.254: 34.16,60.58 34.16,60.71 33.02,61.85 v33.02,65.91 32.77,66.17 32.77,72.14 v31.88,73.03
  Top 0.508: 34.16,60.58 34.16,55.63 36.07,53.72 v36.07,53.34
  Bottom 0.254: LCD.24 32.8,38.27 34.8,40.27 34.8,46.99 36.07,48.26 | LCD_A64-OLINUXINO.16 31.97,72.93 v31.88,73.03
  Bottom 0.508: LCD_LIME.16 32.89,65.79 v33.02,65.91
  Bottom 0.762: LCD_LIME.16 LCD_LIME2.16
  Bottom 1.016: 36.07,48.26 LCD_CON.16 v36.07,53.34
LCD_G4  (via drill 0.3, 0.6)
  Top 0.254: v31.62,69.98 32.13,69.47 32.13,61.85 33.4,60.58 33.4,55.24 | v34.8,53.47 34.8,53.21 32.13,50.55 15.24,50.55 9.02,44.32 4.95,44.32 3.05,46.23 3.05,53.09 3.56,53.59 3.56,57.28 v2.67,58.17
  Top 0.508: 33.4,55.24 34.8,53.85 v34.8,53.47
  Bottom 0.254: LCD.23 32.3,38.54 33.53,39.77 33.53,41.92 | 33.53,46.99 34.8,48.26 v34.8,53.47 | LCD_A64-OLINUXINO.17 31.47,70.26 31.62,70.1 v31.62,69.98
  Bottom 0.508: v31.62,69.98 LCD_LIME.17 | LCD_LIME2.17 31.62,56.26 33.15,54.74 33.78,54.74 34.8,53.72 v34.8,53.47
  Bottom 1.016: 33.53,41.92 LCD_CON.17 33.53,46.99 | 2.41,58.17 R36.1 | v2.67,58.17 2.41,58.17 | 2.41,58.17 R40.2
LCD_G5  (via drill 0.3, 0.6)
  Top 0.254: 32.64,54.74 32.64,60.45 31.37,61.72 v31.37,65.91 31.37,68.71 30.86,69.22 v30.86,73.03 | v33.53,53.47 33.53,53.21 31.37,51.05 14.99,51.05 8.76,44.83 5.21,44.83 3.56,46.48 3.56,52.83 4.06,53.34 4.06,58.04 v3.94,58.17
  Top 0.508: v33.53,53.47 33.53,53.85 32.64,54.74
  Bottom 0.254: LCD.22 31.8,38.8 32.26,39.26 32.26,46.99 33.53,48.26 | LCD_A64-OLINUXINO.18 30.97,72.92 v30.86,73.03
  Bottom 0.508: v31.37,65.91 31.37,65.66 31.62,65.41 LCD_LIME.18
  Bottom 0.762: LCD_LIME.18 LCD_LIME2.18
  Bottom 1.016: 33.53,48.26 LCD_CON.18 v33.53,53.47 | R35.1 v3.94,58.17 R39.2
LCD_G6  (via drill 0.3, 0.6)
  Top 0.254: v30.61,67.18 30.35,66.93 30.35,61.85 31.88,60.33 31.88,54.23 | v32.26,53.47 32.26,53.21 30.61,51.56 14.73,51.56 8.51,45.34 5.46,45.34 4.06,46.74 4.06,52.58 4.57,53.09 4.57,57.28 v5.46,58.17
  Top 0.508: v32.26,53.47 32.26,53.85 31.88,54.23
  Bottom 0.254: LCD.21 31.3,38.82 30.99,39.13 30.99,41.92 | 30.99,46.99 32.26,48.26 v32.26,53.47 | LCD_A64-OLINUXINO.19 30.47,69.84 30.35,69.72
  Bottom 0.508: v30.61,67.18 30.61,67.44 30.35,67.69 LCD_LIME.19 30.35,69.72 | v32.26,53.47 32.26,54.36 30.35,56.26 LCD_LIME2.19
  Bottom 1.016: 30.99,41.92 LCD_CON.19 30.99,46.99 | R34.1 v5.46,58.17 R38.2
LCD_G7  (via drill 0.3, 0.6)
  Top 0.254: v30.99,58.8 30.99,60.33 29.84,61.47 29.84,68.83 30.23,69.22 30.23,72.64 v29.84,73.03 | v30.99,53.47 30.99,53.21 29.84,52.07 14.48,52.07 8.26,45.85 5.71,45.85 4.57,46.99 4.57,52.32 5.08,52.83 5.08,56.26 v6.99,58.17
  Top 0.508: v30.99,53.47 v30.99,58.8
  Bottom 0.254: LCD.20 30.8,38.56 29.72,39.64 29.72,46.99 30.99,48.26 | LCD_A64-OLINUXINO.20 29.97,72.9 v29.84,73.03
  Bottom 0.508: LCD_LIME2.20 30.35,59.44 v30.99,58.8
  Bottom 0.762: LCD_LIME2.20 LCD_LIME.20
  Bottom 1.016: 30.99,48.26 LCD_CON.20 v30.99,53.47 | R33.1 v6.99,58.17 R37.2
LCD_HSYNC  (via drill 0.3, 0.6)
  Top 0.254: v26.04,35.31 22.73,35.31 v21.97,36.07 | v24.77,70.1 24.13,69.47 24.13,64.39 25.02,63.5 25.02,62.61 21.46,59.05 21.46,58.04 19.56,56.13 v19.56,53.47
  Bottom 0.254: LCD.11 26.3,35.04 v26.04,35.31 26.04,36.32 21.21,41.15 20.19,41.15 18.67,42.67 | 18.29,46.99 19.56,48.26 v19.56,53.47 19.56,53.59 20.83,54.86 21.34,54.86 21.84,55.37 22.86,55.37 24,56.52 LCD_LIME2.29 | LCD_A64-OLINUXINO.29 25.47,70.81 v24.77,70.1
  Bottom 0.508: v24.77,70.1 24,69.34 LCD_LIME.29
  Bottom 0.762: v21.97,36.07 21.34,36.7 R5.2
  Bottom 1.016: 18.67,42.67 18.29,43.05 LCD_CON.29 18.29,46.99
LCD_L/R  (via drill 0.3, 0.6)
  Top 0.254: v43.05,34.8 42.67,35.18 27.3,35.18 26.42,36.07 v22.99,36.07
  Bottom 0.254: LCD.39 40.3,30.65 43.05,33.4 v43.05,34.8 | 16.38,40.39 17.65,39.12 20.19,39.12 22.99,36.32 v22.99,36.07
  Bottom 0.508: L/R.1 16.38,40.39
  Bottom 1.016: 44.2,34.8 R31.1 | 44.2,34.8 R25.2 | v43.05,34.8 44.2,34.8
LCD_PWRE  (via drill 0.3, 0.6)
  Top 0.254: v11.94,53.47 11.94,54.86 20.32,63.25 20.32,66.29 19.91,66.7 v19.91,67.18
  Bottom 0.254: 10.67,46.99 11.94,48.26 v11.94,53.47 13.84,55.37 19.05,55.37 20.19,56.52 LCD_LIME2.35 | 11.05,38.35 10.92,38.35 10.16,39.12 10.16,40.01 10.67,40.51 10.67,42.29 | LCD_A64-OLINUXINO.35 22.47,70.86 21.59,69.98 21.08,69.98 20.57,69.47
  Bottom 0.508: v19.91,67.18 19.91,67.54 20.19,67.82 LCD_LIME.35 20.19,69.09 20.57,69.47
  Bottom 0.762: CTRL/EN.3 11.05,38.35
  Bottom 1.016: 10.67,46.99 LCD_CON.35 10.67,42.29
LCD_R0  (via drill 0.3, 0.6)
  Top 0.254: v39.24,69.85 39.88,69.22 39.88,65.02 44.32,60.58 44.32,59.05 v44.07,58.8
  Top 0.508: v44.07,58.8 44.2,58.8 49.02,53.98 49.02,52.96 48.64,52.58 v48.64,47.24
  Bottom 0.203: 39.62,58.04 39.95,58.37 43.64,58.37 v44.07,58.8
  Bottom 0.254: LCD.35 38.3,35.38 42.04,39.12 42.93,39.12 44.07,40.26 45.09,40.26 46.23,41.4 47.62,41.4 48.77,42.55 | LCD_LIME.5 39.24,67.94 | LCD_A64-OLINUXINO.5 37.47,70.86 38.23,70.1 38.99,70.1 v39.24,69.85
  Bottom 0.508: v39.24,69.85 LCD_LIME.5 | LCD_LIME2.5 39.24,57.66 39.62,58.04
  Bottom 1.016: 48.77,42.55 LCD_CON.5 48.77,47.12 v48.64,47.24
LCD_R1  (via drill 0.3, 0.6)
  Top 0.254: v43.33,59.97 43.33,60.68 39.37,64.64 39.37,68.58 38.35,69.6 38.35,71.63 v36.96,73.03
  Top 0.508: v43.33,59.97 43.08,59.72 43.08,58.27 43.56,57.78 44.07,57.78 48.01,53.85 v48.01,53.47
  Bottom 0.203: v43.33,59.97 43.31,59.99 39.95,59.99 39.62,60.33
  Bottom 0.254: 48.77,48.64 47.5,47.37 47.5,42.31 47.1,41.91 45.97,41.91 44.83,40.77 43.8,40.77 42.66,39.62 41.78,39.62 37.8,35.64 LCD.34 | LCD_A64-OLINUXINO.6 36.97,73.01 v36.96,73.03
  Bottom 0.508: LCD_LIME2.6 39.24,60.71 39.62,60.33
  Bottom 0.762: LCD_LIME2.6 LCD_LIME.6
  Bottom 1.016: 48.77,48.64 LCD_CON.6 48.77,52.58 48.01,53.34 v48.01,53.47
LCD_R2  (via drill 0.3, 0.6)
  Top 0.254: v38.61,67.06 38.86,66.8 38.86,64.26 42.47,60.66 42.47,57.73 43.31,56.9 44.07,56.9 47.12,53.85 47.12,52.2 v47.5,51.82
  Bottom 0.254: LCD.33 37.3,35.9 41.53,40.13 42.42,40.13 43.56,41.27 44.58,41.27 45.47,42.16 45.47,42.55 45.72,42.8 | LCD_LIME2.7 37.97,56.52 38.61,55.88 39.75,55.88 40.51,55.12 45.85,55.12 47.12,53.85 47.12,52.2 v47.5,51.82 47.5,48.26 46.23,46.99 | 37.85,69.6 37.85,69.72 36.96,70.61 36.7,70.61 36.47,70.85 LCD_A64-OLINUXINO.7
  Bottom 0.508: v38.61,67.06 37.97,67.69 LCD_LIME.7 37.85,68.71 37.85,69.6
  Bottom 1.016: 45.72,42.8 46.23,43.31 LCD_CON.7 46.23,46.99
LCD_R3  (via drill 0.3, 0.6)
  Top 0.254: v46.23,53.47 46.23,53.72 43.69,56.26 43.18,56.26 41.99,57.45 41.99,60.25 38.1,64.14 v38.1,65.91 37.85,66.17 37.85,71.12 v35.94,73.03
  Bottom 0.254: LCD.32 36.8,36.16 41.27,40.64 42.16,40.64 43.31,41.78 44.32,41.78 44.83,42.29 44.83,46.86 46.23,48.26 | LCD_A64-OLINUXINO.8 35.97,73 v35.94,73.03
  Bottom 0.508: v38.1,65.91 38.1,65.28 37.97,65.15 LCD_LIME.8
  Bottom 0.762: LCD_LIME.8 LCD_LIME2.8
  Bottom 1.016: 46.23,48.26 LCD_CON.8 v46.23,53.47
LCD_R4  (via drill 0.3, 0.6)
  Top 0.254: v36.7,69.85 37.34,69.22 37.34,64.01 40.31,61.04 40.31,58.37 44.96,53.72 v44.96,53.47
  Bottom 0.254: LCD.31 36.3,36.42 41.02,41.15 41.91,41.15 43.69,42.93 | LCD_LIME.9 v36.7,69.85 36.58,69.98 36.32,69.98 35.47,70.83 LCD_A64-OLINUXINO.9 | LCD_LIME2.9 36.7,56.64 37.97,55.37 39.5,55.37 40.26,54.61 43.81,54.61 v44.96,53.47 44.96,48.26 43.69,46.99
  Bottom 0.508: v36.7,69.85 LCD_LIME.9
  Bottom 1.016: 43.69,42.93 LCD_CON.9 43.69,46.99
LCD_R5  (via drill 0.3, 0.6)
  Top 0.254: v43.69,53.47 43.69,54.23 39.47,58.45 v39.47,59.18 39.47,60.98 36.83,63.63 36.83,68.58 35.94,69.47 35.94,72.01 v34.92,73.03
  Bottom 0.254: LCD.30 35.8,36.69 40.77,41.66 41.66,41.66 42.42,42.42 42.42,46.99 43.69,48.26 | 37.08,60.33 37.47,59.94 38.71,59.94 v39.47,59.18 | LCD_A64-OLINUXINO.10 34.97,72.98 v34.92,73.03
  Bottom 0.508: LCD_LIME2.10 36.7,60.71 37.08,60.33
  Bottom 0.762: LCD_LIME2.10 LCD_LIME.10
  Bottom 1.016: 43.69,48.26 LCD_CON.10 v43.69,53.47
LCD_R6  (via drill 0.3, 0.6)
  Top 0.254: v36.07,67.06 36.07,63.5 38.61,60.96 38.61,57.02 v42.42,53.21
  Bottom 0.254: LCD.29 35.3,36.95 40.51,42.16 40.51,42.42 40.64,42.55 | LCD_LIME2.11 35.43,56.52 36.07,55.88 36.7,55.88 37.72,54.86 39.24,54.86 40.01,54.1 41.53,54.1 v42.42,53.21 42.42,48.26 41.15,46.99 | LCD_A64-OLINUXINO.11 34.47,70.81 35.43,69.85
  Bottom 0.508: v36.07,67.06 35.43,67.69 LCD_LIME.11 35.43,69.85
  Bottom 1.016: 40.64,42.55 41.15,43.05 LCD_CON.11 41.15,46.99
LCD_R7  (via drill 0.3, 0.6)
  Top 0.254: v41.15,53.21 41.15,53.72 37.72,57.15 v37.72,59.05 37.72,60.96 35.31,63.37 35.31,71.63 v33.91,73.03
  Bottom 0.254: LCD.28 34.8,37.21 39.75,42.16 39.75,46.86 41.15,48.26 | 35.43,60.33 35.81,59.94 36.58,59.94 37.47,59.05 v37.72,59.05 | LCD_A64-OLINUXINO.12 33.97,72.97 v33.91,73.03
  Bottom 0.762: LCD_LIME.12 LCD_LIME2.12 35.43,60.33
  Bottom 1.016: 41.15,48.26 LCD_CON.12 v41.15,53.21
LCD_U/D  (via drill 0.3, 0.6)
  Top 0.254: v21.97,32.77 23.24,31.5 v43.05,31.5
  Bottom 0.254: v43.05,31.5 42.04,31.5 40.8,30.26 LCD.40 | v21.97,32.77 20.07,32.77 19.94,32.89 19.94,37.72 19.05,38.61 16.76,38.61 16.64,38.73
  Bottom 0.508: 16.64,38.73 16,38.73 U/D.1
  Bottom 1.016: v43.05,31.5 R30.1 R24.2
LCD_VSYNC  (via drill 0.3, 0.6)
  Top 0.254: v25.53,34.42 25.15,34.8 22.23,34.8 v21.97,35.05 | v18.29,53.47 18.29,55.63 20.95,58.29 20.95,59.31 24.13,62.48 v24.13,62.99 24.13,63.37 23.62,63.88 23.62,71.88 v24.77,73.03
  Bottom 0.254: LCD.10 25.8,34.15 v25.53,34.42 25.53,34.54 25.27,34.8 25.27,36.32 20.95,40.64 18.8,40.64 17.02,42.42 17.02,46.99 18.29,48.26 | LCD_A64-OLINUXINO.30 24.97,72.82 v24.77,73.03
  Bottom 0.762: v21.97,35.05 20.95,35.05 R4.2 | 24,62.99 LCD_LIME2.30 | 24,62.99 LCD_LIME.30 | v24.13,62.99 24,62.99
  Bottom 1.016: 18.29,48.26 LCD_CON.30 v18.29,53.47
N$1
  Bottom 0.254: LCD.8 24.8,27.53 21.97,30.35 21.59,30.35
  Bottom 1.016: 21.59,30.35 R7.2 R6.2
N$2
  Bottom 1.016: D4.3 49.66,31.45 C14.2
N$3  (via drill 0.6)
  Top 0.254: v13.34,40.64 13.72,41.02 42.29,41.02 v44.45,38.86
  Top 1.016: v40.51,70.1 41.15,70.1 46.61,64.64 46.61,59.82 v49.15,57.28 51.31,55.12 51.31,52.83 49.91,51.44 49.91,45.59 50.16,45.34 v50.16,42.55 50.16,40.13 49.66,39.62 45.21,39.62 v44.45,38.86
  Bottom 0.254: LCD_A64-OLINUXINO.3 38.47,70.75 38.61,70.61 40.01,70.61 v40.51,70.1
  Bottom 0.508: LCD_LIME2.3 40.51,56.26 41.02,55.75 48.39,55.75 49.15,56.52 v49.15,57.28 | R2.2 43.69,38.86 v44.45,38.86
  Bottom 0.762: v40.51,70.1 LCD_LIME.3 | CTRL/EN.1 v13.34,40.64
  Bottom 1.016: LCD_CON.3 51.31,43.31 50.55,42.55 v50.16,42.55 | FET2.2 46.8,40.45 C22.1 44.96,39.37 v44.45,38.86
N$4
  Bottom 1.016: D4.2 49.28,28.68 C11.1 49.28,25.53 R11.2
N$5
  Bottom 0.508: U1.3 5.97,32.32 5.97,32.64
  Bottom 1.016: R9.1 R8.1 5.97,32.64
N$6
  Bottom 1.016: R10.2 57.78,26.67 C10.1 56.7,27.75 D3.1
N$7  (via drill 0.6)
  Top 1.016: v45.47,69.09 48.51,69.09 50.42,67.18 50.42,63.75 52.7,61.47 54.48,61.47 56.77,59.18 56.77,50.67 55.24,49.15 55.24,46.35 54.1,45.21 v54.1,38.61
  Bottom 0.762: v45.47,69.09 5V_JACK/5V_LCD_CON.2
  Bottom 1.016: C21.1 R1.2 53.34,37.85 v54.1,38.61 54.8,39.3 FET1.2
N$8
  Bottom 1.016: R2.1 C22.2 47.62,37.59 | D1.1 47.82,36.89 47.62,37.08 47.62,37.59 | FET2.1 47.62,38.34 47.62,37.59
N$9
  Bottom 0.762: FET1.1 54.8,37.4 53.47,36.07 R1.1
  Bottom 1.016: R1.1 C21.2 50.18,36.07 D1.2
N$10
  Bottom 1.016: D3.3 55.75,31.3 54.04,31.3 53.59,30.86 C13.1
N$11
  Bottom 1.016: R32.1 53.72,34.54 54.99,35.81 56.22,35.81 T1.3
N$12
  Bottom 1.016: R14.2 R9.2 10.41,35.56 C6.1
N$13
  Bottom 0.508: 5.46,30.1 5.46,30.42 U1.1
  Bottom 1.016: 5.46,30.1 5.46,27.3 L1.2
  Bottom 1.524: L1.2 5.89,25.2 4.67,23.97 D2.A
N$14
  Bottom 1.016: Z3.1 3.81,40.13 R15.2 R13.1 R14.1
N$15  (via drill 0.3, 0.6)
  Top 0.254: v21.34,67.18 21.34,66.93 21.97,66.29 21.97,65.53 21.34,64.9 21.34,61.98 19.43,60.07 19.43,59.05 14.48,54.1 v14.48,53.47
  Bottom 0.254: 13.21,46.99 14.48,48.26 v14.48,53.47 15.88,54.86 19.3,54.86 20.32,55.88 20.83,55.88 21.46,56.52 LCD_LIME2.33 | LCD_CON.33 13.21,42.93 15.24,40.89 | LCD_A64-OLINUXINO.33 23.47,70.84 23.11,70.48 22.86,70.48 21.84,69.47 21.84,69.34
  Bottom 0.508: v21.34,67.18 21.34,67.56 21.46,67.69 LCD_LIME.33 21.46,68.96 21.84,69.34 | L/R.2 15.24,40.89
  Bottom 1.016: LCD_CON.33 13.21,46.99
N$16  (via drill 0.3, 0.6)
  Top 0.254: v57.78,41.91 57.78,32.51 v57.15,31.88 | v49.02,40.77 43.31,40.77 42.55,41.53 12.95,41.53 11.05,39.62 v11.05,39.5
  Bottom 0.254: v57.78,41.91 57.66,41.91 57.4,41.66 49.91,41.66 v49.02,40.77
  Bottom 0.508: T1.1 57.15,32.75 v57.15,31.88
  Bottom 0.762: CTRL/EN.2 v11.05,39.5
N$17  (via drill 0.3, 0.6)
  Top 0.254: v13.21,53.47 13.21,55.37 20.83,62.99 20.83,65.53 v21.21,65.91 21.21,66.29 20.62,66.88 20.62,68.38 22.35,70.1 22.35,72.64 v22.73,73.03
  Bottom 0.254: 14.61,39.5 14.48,39.62 14.48,40.89 13.59,41.78 12.45,41.78 11.94,42.29 11.94,46.99 13.21,48.26 | LCD_A64-OLINUXINO.34 22.97,72.79 v22.73,73.03
  Bottom 0.508: LCD_LIME.34 21.46,65.41 21.21,65.66 v21.21,65.91 | 14.61,39.5 U/D.2
  Bottom 0.762: LCD_LIME.34 21.46,63.63 21.21,63.37 21.21,62.36 21.46,62.1 LCD_LIME2.34
  Bottom 1.016: v13.21,53.47 LCD_CON.34 13.21,48.26
N$18
  Bottom 0.762: 5V/3.3V.1 53.72,40.51 53.85,40.64
  Bottom 1.016: FET1.3 57.74,39.54 56.64,40.64 53.85,40.64
N$19
  Bottom 1.016: D1.3 48.98,34.54 R32.2
N$22  (via drill 0.6)
  Top 1.016: v46.74,71.75 43.18,75.31 17.02,75.31 13.34,71.63 13.34,67.18 10.79,64.64 v4.45,64.64 v4.45,65.66
  Bottom 0.762: 46.74,70.61 5V_JACK/5V_LCD_CON.1
  Bottom 1.016: v46.74,71.75 46.74,70.61 | PWR_JACK.1 2.38,64.64 v4.45,64.64 v4.45,65.66 2.41,65.66 PWR_JACK.1
N$23  (via drill 0.6)
  Top 1.016: v50.04,53.85 50.04,54.48 v47.75,56.77 45.34,59.18 45.34,64.14 v42.8,66.67
  Bottom 0.254: 39.47,71.5 LCD_A64-OLINUXINO.1 | 39.85,71.5 39.47,71.5 | 39.47,71.5 39.47,71.88 39.88,71.88 | 39.47,71.5 39.47,71.12 39.88,71.12
  Bottom 0.762: LCD_LIME2.1 41.78,56.77 v47.75,56.77 | 41.91,68.58 LCD_LIME.1 | 44.2,70.61 5V_JACK/5V_LCD_CON.3
  Bottom 1.016: LCD_CON.1 53.85,46.23 55.24,47.62 55.24,53.21 54.81,53.65 50.24,53.65 v50.04,53.85 | v42.8,66.67 41.91,67.56 41.91,68.58 41.91,70.23 42.16,70.48 | 42.16,70.48 42.29,70.61 44.2,70.61 | 42.16,70.48 41.15,71.5 39.85,71.5
N$42
  Bottom 0.254: LCD.47 44.3,22.07 44.58,22.35
  Bottom 0.508: 44.58,22.35 44.58,22.99 R20.2
  Bottom 1.016: R20.2 R19.2
N$123  (via drill 0.6)
  Top 1.016: v54.1,33.27 54.1,36.7 55.37,37.97 55.37,44.58 56.52,45.72 v56.52,46.48
  Bottom 0.508: 51.69,60.58 51.69,61 U2.1
  Bottom 1.016: C14.1 C13.2 53.59,33.27 v54.1,33.27 | v56.52,46.48 56.52,53.85 55.45,54.91 52.53,54.91 50.85,56.59 L2.2
  Bottom 1.27: L2.2 50.85,58.33 | 50.85,58.33 50.85,59.74 51.69,60.58 | 50.85,58.33 50.85,58.93 48.39,58.93 D5.A
N$126  (via drill 0.6)
  Top 1.016: v51.7,64.26 52.21,64.77 v54.36,64.77
  Bottom 0.508: U2.3 51.7,62.93 51.7,63.25
  Bottom 1.016: 51.7,63.25 v51.7,64.26 | v54.36,64.77 R26.1 R18.1
RESET
  Bottom 0.254: LCD.44 42.8,22.35 42.67,22.48 42.67,26.16
  Bottom 0.508: 42.67,26.16 42.67,26.92
  Bottom 1.016: R23.2 42.67,26.92 C20.1
TPX1  (via drill 0.3, 0.6)
  Top 0.254: v18.92,69.85 16.64,67.56 16.64,61.85 8.89,54.1 v8.89,53.72 8.64,53.47 8.64,49.78 8.26,49.4 v8.26,47.24 | v3.56,43.81 v3.56,42.04
  Bottom 0.254: 4.45,18.8 3.68,18.8 1.52,20.95 1.52,42.16 3.17,43.81 v3.56,43.81 | LCD_LIME2.37 18.92,56.52 18.29,55.88 13.34,55.88 12.06,54.61 9.78,54.61 v8.89,53.72 | LCD_A64-OLINUXINO.37 21.47,70.74 21.21,70.48 20.83,70.48 20.45,70.1 19.18,70.1 v18.92,69.85 | 7.37,42.16 6.99,41.78 3.81,41.78 v3.56,42.04
  Bottom 0.508: 4.45,18.8 R27.2 5.33,9.53 LCD.51 9.65,3.94 29.21,3.94 34.29,9.02 43.81,9.02 TP1.P$1
  Bottom 0.61: LCD_CON.37 8.13,42.93 7.37,42.16
  Bottom 0.762: v18.92,69.85 LCD_LIME.37
  Bottom 0.813: 8.13,46.99 8.26,47.12 v8.26,47.24
  Bottom 1.016: LCD_CON.37 8.13,46.99
TPX2  (via drill 0.3, 0.6)
  Top 0.254: v8.13,19.3 6.73,20.7 v3.81,20.7 | v9.27,48.64 9.27,52.7 9.78,53.21 9.78,54.23 17.14,61.59 17.14,65.94 v17.32,66.12 17.32,66.85 20.7,70.23 v20.7,73.03
  Bottom 0.203: 18.49,65.58 arc45 17.82,65.86 17.8,65.86 arc-45 v17.32,66.12
  Bottom 0.254: v3.81,20.7 2.54,21.97 2.54,40.89 2.79,41.15 8.26,41.15 9.14,42.04 9.14,48.51 v9.27,48.64 | LCD_A64-OLINUXINO.38 20.97,72.76 v20.7,73.03
  Bottom 0.508: v8.13,19.3 8.13,18.05 7.75,17.67 7.75,9.78 LCD.53 10.92,5.59 11.05,5.46 28.45,5.46 33.53,10.54 45.09,10.54 TP1.P$3 | LCD_LIME.38 18.92,65.15 18.49,65.58
  Bottom 0.762: LCD_LIME.38 LCD_LIME2.38
  Bottom 1.016: LCD_CON.38 8.13,49.28 8.76,48.64 v9.27,48.64
TPY1  (via drill 0.3, 0.6)
  Top 0.254: v17.65,69.98 16.13,68.45 16.13,62.1 9.65,55.63 9.14,55.63 v8.89,55.37 8,54.48 8,50.16 5.46,47.62 v5.46,47.37
  Bottom 0.254: R28.2 6.86,18.92 6.1,19.68 3.56,19.68 2.03,21.21 2.03,41.78 3.17,42.93 4.57,42.93 | LCD_LIME2.39 17.65,56.39 12.83,56.39 11.81,55.37 v8.89,55.37 | LCD_A64-OLINUXINO.39 20.47,70.89 20.19,70.61 18.29,70.61 v17.65,69.98
  Bottom 0.508: R28.2 6.86,9.27 LCD.52 10.41,4.7 28.83,4.7 33.91,9.78 44.45,9.78 TP1.P$2
  Bottom 0.762: 4.57,42.93 5.08,42.93 5.59,43.43 LCD_CON.39 | v17.65,69.98 LCD_LIME.39 17.65,68.45
  Bottom 0.813: 5.59,46.99 5.59,47.24 v5.46,47.37
  Bottom 1.016: LCD_CON.39 5.59,46.99
TPY2  (via drill 0.6)
  Top 0.254: v8.76,17.03 v4.32,17.03
  Bottom 0.254: 4.95,49.02 4.32,48.39 4.32,46.1 1.02,42.8 1.02,20.7 4.32,17.4 v4.32,17.03 | 17.65,59.94 16.64,58.93 16.64,57.4 16.13,56.9 12.32,56.9 11.68,56.26 8.38,56.26 8,55.88 8,54.61 6.48,53.09 | LCD_A64-OLINUXINO.40 19.97,71.25 17.53,71.25 16.64,70.36 16.64,65.53 17.14,65.02
  Bottom 0.508: v8.76,17.03 8.76,10.03 LCD.54 11.68,6.22 28.07,6.22 33.15,11.3 45.85,11.3 TP1.P$4 | 17.65,59.94 LCD_LIME2.40
  Bottom 0.61: LCD_CON.40 5.59,52.2 6.48,53.09
  Bottom 0.762: LCD_LIME2.40 LCD_LIME.40 17.65,65.02 17.14,65.02
  Bottom 1.016: 4.95,49.02 5.59,49.66 LCD_CON.40
VCC  (via drill 0.6, 0.6 pad 1.02)
  Top 0.508: v8.89,38.35 8.38,38.86 4.7,38.86 2.41,41.15 2.41,53.72 v2.67,53.98
  Top 1.016: v48.39,32.77 50.29,34.67 v50.29,38.35 45.85,38.35 45.09,37.59 43.81,37.59 42.93,38.48 19.05,38.48 v18.29,37.72 18.03,37.47 9.78,37.47 v8.89,38.35 | 16.51,28.83 v16.51,21.34 44.7,21.34 48.9,17.14 48.9,13.34 50.16,12.06 54.48,12.06 PWR.5 | 16.51,28.83 v16.51,31.88 | 16.51,28.83 v21.97,28.83
  Bottom 0.254: R19.1 45.72,25.4 45.72,30.35 | 23.88,25.02 24.13,25.02 24.3,24.85 24.3,24.02 | 24.3,24.02 LCD.7 | 24.3,24.02 24,24.31 24,24.64
  Bottom 0.508: R28.1 7.37,21.08 16.26,21.08 v16.51,21.34
  Bottom 0.762: 23.88,25.02 23.88,24.77 24,24.64 | 5V/3.3V.3 51.05,40.26 50.29,39.5 | v48.39,32.77 48.39,31.11 47.62,30.35 45.72,30.35 43.81,30.35 43.31,29.84 R23.1
  Bottom 1.016: R24.1 R25.1 R24.1 | v48.39,32.77 46.23,32.77 R24.1 | 23.88,25.02 23.88,26.16 22.73,27.3 C1.1 C2.1 v21.97,28.83 | v8.89,38.35 8.64,38.61 R13.2 | R6.1 v16.51,31.88 16.51,33.66 18.03,35.18 R4.1 R5.1 19.05,36.96 v18.29,37.72 | R27.1 R28.1 | FET2.3 50.29,39.5 v50.29,38.35 | 2.67,55.24 R35.2 R34.2 R33.2 | 2.67,55.24 R36.2 | v2.67,53.98 2.67,55.24
VCOM  (via drill 0.6)
  Top 1.016: PWR.4 55.75,13.34 50.8,13.34 50.16,13.97 50.16,17.65 44.96,22.86 v43.56,22.86 24.13,22.86 v22.86,24.13
  Bottom 0.254: 23.8,22.05 23.8,23.45 23.62,23.62 23.37,23.62 | LCD.6 23.8,22.05 | 23.8,22.05 23.5,22.35 | LCD.46 43.8,22.62 v43.56,22.86
  Bottom 0.508: 23.5,22.35 23.5,23.5 23.37,23.62
  Bottom 0.762: 43.56,25.27 44.45,26.16 C19.1
  Bottom 1.016: R22.2 R29.1 C19.1 | Z4.1 21.64,25.35 v22.86,24.13 23.37,23.62 | v43.56,22.86 43.56,25.27
VLED+  (via drill 0.6)
  Top 1.016: v9.53,24.26 9.53,28.83 v6.99,31.37
  Bottom 0.254: LCD.1 21.3,22.23 21.8,22.23 | 21.8,22.23 LCD.2 | 21.8,22.23 21.42,22.61 21.08,22.61
  Bottom 0.508: v6.99,31.37 U1.5
  Bottom 1.016: D2.K 9.53,22.77 v9.53,24.26 | 15.37,22.73 C3.1 | 16,22.73 16,22.61 21.08,22.61
  Bottom 1.27: D2.K C5.1 C4.1 15.37,22.73 16,22.73
VLED-  (via drill 0.6)
  Top 1.016: v9.02,34.04 13.46,29.59 v13.46,27.3
  Bottom 0.254: LCD.4 22.8,22.29 22.61,22.48 22.55,22.48 | 22.55,22.48 22.35,22.48 22.3,22.43 LCD.3 | 22.55,22.5 22.55,22.48
  Bottom 0.762: v13.46,27.3 15.49,27.3 16.76,26.04 16.76,24.38 17.27,23.88 | 21.29,23.88 21.46,23.88 22.55,22.78 22.55,22.5
  Bottom 1.016: R8.2 v9.02,34.04 R12.1 | 17.27,23.88 21.29,23.88

## Text on the board
tNames: Da se iztrie beliq pe4at na LCD-to v TopSilk!
bNames: 3 | 1 | o | 5VDC only! | 40 | 39 | 1 | 1 | 3 | 1 | LCD-OLINUXINO-7TS | 3 | Rev.F | (C) 2026 | https://www.olimex.com | 1 | +16V | +10.4V | (5V/3.3V) | DCDC_VCC | +3.8V | +3.3V | -6.8V | GND | GND
tDocu: 30 total errors